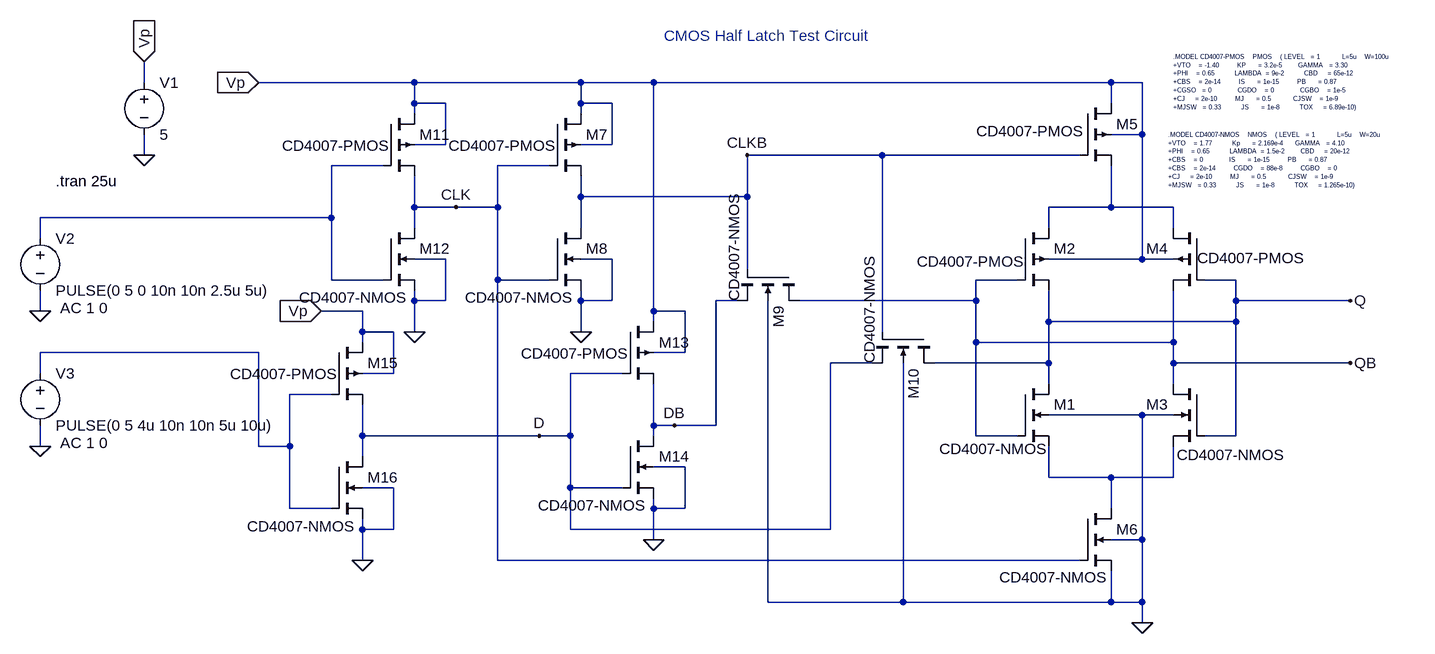
[diagram p0: schematic cmos_latch-cd4007.asc]
cmos_latch-cd4007.asc, the LTspice schematic file:
Version 4
SHEET 1 1696 680
WIRE -688 -1376 -688 -1408
WIRE -272 -1376 -512 -1376
WIRE -16 -1376 -272 -1376
WIRE 96 -1376 -16 -1376
WIRE 800 -1376 96 -1376
WIRE 848 -1376 800 -1376
WIRE -272 -1344 -272 -1376
WIRE -224 -1344 -272 -1344
WIRE -16 -1344 -16 -1376
WIRE 32 -1344 -16 -1344
WIRE 800 -1344 800 -1376
WIRE -272 -1328 -272 -1344
WIRE -16 -1328 -16 -1344
WIRE 848 -1296 848 -1376
WIRE 848 -1296 800 -1296
WIRE -224 -1280 -224 -1344
WIRE -224 -1280 -272 -1280
WIRE 32 -1280 32 -1344
WIRE 32 -1280 -16 -1280
WIRE -688 -1264 -688 -1296
WIRE 448 -1264 240 -1264
WIRE 752 -1264 448 -1264
WIRE -320 -1248 -400 -1248
WIRE -64 -1248 -144 -1248
WIRE -16 -1200 -16 -1232
WIRE 240 -1200 240 -1264
WIRE 240 -1200 -16 -1200
WIRE -272 -1184 -272 -1232
WIRE -208 -1184 -272 -1184
WIRE -144 -1184 -144 -1248
WIRE -144 -1184 -208 -1184
WIRE 800 -1184 800 -1248
WIRE 800 -1184 704 -1184
WIRE 896 -1184 800 -1184
WIRE -400 -1168 -400 -1248
WIRE -400 -1168 -848 -1168
WIRE -272 -1152 -272 -1184
WIRE -16 -1152 -16 -1200
WIRE 704 -1152 704 -1184
WIRE 896 -1152 896 -1184
WIRE -848 -1136 -848 -1168
WIRE -224 -1104 -272 -1104
WIRE 32 -1104 -16 -1104
WIRE 848 -1104 848 -1296
WIRE 848 -1104 704 -1104
WIRE 896 -1104 848 -1104
WIRE 240 -1088 240 -1200
WIRE -400 -1072 -400 -1168
WIRE -320 -1072 -400 -1072
WIRE -144 -1072 -144 -1184
WIRE -64 -1072 -144 -1072
WIRE 656 -1072 592 -1072
WIRE 992 -1072 944 -1072
WIRE -272 -1040 -272 -1056
WIRE -224 -1040 -224 -1104
WIRE -224 -1040 -272 -1040
WIRE -16 -1040 -16 -1056
WIRE 32 -1040 32 -1104
WIRE 32 -1040 -16 -1040
WIRE 224 -1040 192 -1040
WIRE 592 -1040 592 -1072
WIRE 592 -1040 320 -1040
WIRE 992 -1040 992 -1072
WIRE 1168 -1040 992 -1040
WIRE -848 -1024 -848 -1056
WIRE -352 -1024 -416 -1024
WIRE 96 -1024 96 -1376
WIRE 144 -1024 96 -1024
WIRE 96 -1008 96 -1024
WIRE 704 -1008 704 -1056
WIRE 992 -1008 992 -1040
WIRE 992 -1008 704 -1008
WIRE -352 -992 -352 -1024
WIRE -304 -992 -352 -992
WIRE -272 -992 -272 -1040
WIRE -16 -992 -16 -1040
WIRE 448 -992 448 -1264
WIRE -352 -976 -352 -992
WIRE 592 -976 592 -1040
WIRE 896 -976 896 -1056
WIRE 896 -976 592 -976
WIRE -512 -960 -848 -960
WIRE 144 -960 144 -1024
WIRE 144 -960 96 -960
WIRE 432 -944 368 -944
WIRE 704 -944 704 -1008
WIRE 704 -944 528 -944
WIRE 896 -944 896 -976
WIRE 1168 -944 896 -944
WIRE -848 -928 -848 -960
WIRE -304 -928 -304 -992
WIRE -304 -928 -352 -928
WIRE 48 -928 -32 -928
WIRE 704 -912 704 -944
WIRE 896 -912 896 -944
WIRE -400 -896 -464 -896
WIRE 848 -864 704 -864
WIRE 896 -864 848 -864
WIRE 96 -848 96 -912
WIRE 128 -848 96 -848
WIRE 192 -848 192 -1040
WIRE 192 -848 128 -848
WIRE -352 -832 -352 -880
WIRE -80 -832 -352 -832
WIRE -32 -832 -32 -928
WIRE -32 -832 -80 -832
WIRE 96 -832 96 -848
WIRE 592 -832 592 -976
WIRE 656 -832 592 -832
WIRE 992 -832 992 -1008
WIRE 992 -832 944 -832
WIRE -848 -816 -848 -848
WIRE -512 -816 -512 -960
WIRE -464 -816 -464 -896
WIRE -464 -816 -512 -816
WIRE -352 -800 -352 -832
WIRE 144 -784 96 -784
WIRE 704 -768 704 -816
WIRE 800 -768 704 -768
WIRE 896 -768 896 -816
WIRE 896 -768 800 -768
WIRE -304 -752 -352 -752
WIRE -32 -752 -32 -832
WIRE 48 -752 -32 -752
WIRE -464 -720 -464 -816
WIRE -400 -720 -464 -720
WIRE 96 -720 96 -736
WIRE 144 -720 144 -784
WIRE 144 -720 96 -720
WIRE 800 -720 800 -768
WIRE -352 -688 -352 -704
WIRE -304 -688 -304 -752
WIRE -304 -688 -352 -688
WIRE -32 -688 -32 -752
WIRE 368 -688 368 -944
WIRE 368 -688 -32 -688
WIRE 96 -672 96 -720
WIRE 848 -672 848 -864
WIRE 848 -672 800 -672
WIRE -352 -640 -352 -688
WIRE -144 -640 -144 -1072
WIRE 752 -640 -144 -640
WIRE 272 -576 272 -1040
WIRE 480 -576 480 -944
WIRE 480 -576 272 -576
WIRE 800 -576 800 -624
WIRE 800 -576 480 -576
WIRE 848 -576 848 -672
WIRE 848 -576 800 -576
WIRE 848 -544 848 -576
FLAG 848 -544 0
FLAG -512 -1376 Vp
IOPIN -512 -1376 In
FLAG -688 -1264 0
FLAG -688 -1408 Vp
IOPIN -688 -1408 In
FLAG -16 -992 0
FLAG -848 -1024 0
FLAG -208 -1184 CLK
FLAG 1168 -1040 Q
FLAG 1168 -944 QB
FLAG 96 -672 0
FLAG -80 -832 D
FLAG 240 -1264 CLKB
FLAG 128 -848 DB
FLAG -848 -816 0
FLAG -272 -992 0
FLAG -352 -640 0
FLAG -416 -1024 Vp
IOPIN -416 -1024 In
SYMBOL voltage -688 -1392 R0
WINDOW 123 0 0 Left 0
WINDOW 39 0 0 Left 0
SYMATTR InstName V1
SYMATTR Value 5
SYMBOL nmos4 656 -912 R0
WINDOW 3 -120 100 Left 2
SYMATTR Value CD4007-NMOS
SYMATTR InstName M1
SYMBOL pmos4 656 -1152 R0
WINDOW 3 -155 52 Left 2
SYMATTR Value CD4007-PMOS
SYMATTR InstName M2
SYMBOL nmos4 944 -912 M0
WINDOW 3 -126 109 Left 2
SYMATTR Value CD4007-NMOS
SYMATTR InstName M3
SYMBOL pmos4 944 -1152 M0
WINDOW 3 -156 46 Left 2
SYMATTR Value CD4007-PMOS
SYMATTR InstName M4
SYMBOL pmos4 752 -1344 R0
WINDOW 3 -159 43 Left 2
SYMATTR Value CD4007-PMOS
SYMATTR InstName M5
SYMBOL nmos4 752 -720 R0
WINDOW 3 -124 106 Left 2
SYMATTR Value CD4007-NMOS
SYMATTR InstName M6
SYMBOL pmos4 -64 -1328 R0
WINDOW 3 -156 49 Left 2
SYMATTR Value CD4007-PMOS
SYMATTR InstName M7
SYMBOL nmos4 -64 -1152 R0
WINDOW 3 -130 107 Left 2
SYMATTR Value CD4007-NMOS
SYMATTR InstName M8
SYMBOL voltage -848 -1152 R0
WINDOW 123 31 123 Left 2
WINDOW 39 0 0 Left 0
SYMATTR Value2 AC 1 0
SYMATTR InstName V2
SYMATTR Value PULSE(0 5 0 10n 10n 2.5u 5u)
SYMBOL nmos4 320 -1088 R90
WINDOW 3 -120 100 Left 2
SYMATTR Value CD4007-NMOS
SYMATTR InstName M9
SYMBOL nmos4 528 -992 R90
WINDOW 3 -120 100 Left 2
SYMATTR Value CD4007-NMOS
SYMATTR InstName M10
SYMBOL pmos4 48 -1008 R0
WINDOW 3 -156 49 Left 2
SYMATTR Value CD4007-PMOS
SYMATTR InstName M13
SYMBOL nmos4 48 -832 R0
WINDOW 3 -130 107 Left 2
SYMATTR Value CD4007-NMOS
SYMATTR InstName M14
SYMBOL voltage -848 -944 R0
WINDOW 123 31 123 Left 2
WINDOW 39 0 0 Left 0
SYMATTR Value2 AC 1 0
SYMATTR InstName V3
SYMATTR Value PULSE(0 5 4u 10n 10n 5u 10u)
SYMBOL pmos4 -320 -1328 R0
WINDOW 3 -156 49 Left 2
SYMATTR Value CD4007-PMOS
SYMATTR InstName M11
SYMBOL nmos4 -320 -1152 R0
WINDOW 3 -130 107 Left 2
SYMATTR Value CD4007-NMOS
SYMATTR InstName M12
SYMBOL pmos4 -400 -976 R0
WINDOW 3 -156 49 Left 2
SYMATTR Value CD4007-PMOS
SYMATTR InstName M15
SYMBOL nmos4 -400 -800 R0
WINDOW 3 -130 107 Left 2
SYMATTR Value CD4007-NMOS
SYMATTR InstName M16
TEXT 896 -1416 Left 0 !.MODEL CD4007-PMOS    PMOS    ( LEVEL   = 1           L=5u    W=100u                \n+VTO    = -1.40         KP      = 3.2e-5        GAMMA   = 3.30  \n+PHI    = 0.65          LAMBDA  = 9e-2          CBD     = 65e-12\n+CBS    = 2e-14         IS      = 1e-15         PB      = 0.87\n+CGSO   = 0             CGDO    = 0             CGBO    = 1e-5\n+CJ     = 2e-10         MJ      = 0.5           CJSW    = 1e-9\n+MJSW   = 0.33          JS      = 1e-8          TOX     = 6.89e-10)
TEXT 888 -1296 Left 0 !.MODEL CD4007-NMOS    NMOS    ( LEVEL   = 1           L=5u    W=20u             \n+VTO    = 1.77          Kp      = 2.169e-4      GAMMA   = 4.10  \n+PHI    = 0.65          LAMBDA  = 1.5e-2        CBD     = 20e-12\n+CBS    = 0             IS      = 1e-15         PB      = 0.87\n+CBS    = 2e-14         CGDO    = 88e-8         CGBO    = 0\n+CJ     = 2e-10         MJ      = 0.5           CJSW    = 1e-9\n+MJSW   = 0.33          JS      = 1e-8          TOX     = 1.265e-10)
TEXT 112 -1448 Left 2 ;CMOS Half Latch Test Circuit
TEXT -824 -1224 Left 2 !.tran 25u

The netlist it stands for:
* cmos_latch-cd4007.asc
V1 Vp 0 5
M1 Q QB N004 0 CD4007-NMOS
M2 N002 QB Q Vp CD4007-PMOS
M3 QB Q N004 0 CD4007-NMOS
M4 N002 Q QB Vp CD4007-PMOS
M5 Vp CLKB N002 Vp CD4007-PMOS
M6 N004 CLK 0 0 CD4007-NMOS
M7 Vp CLK CLKB Vp CD4007-PMOS
M8 CLKB CLK 0 0 CD4007-NMOS
V2 N001 0 PULSE(0 5 0 10n 10n 2.5u 5u) AC 1 0
M9 QB CLKB DB 0 CD4007-NMOS
M10 Q CLKB D 0 CD4007-NMOS
M13 Vp D DB Vp CD4007-PMOS
M14 DB D 0 0 CD4007-NMOS
V3 N003 0 PULSE(0 5 4u 10n 10n 5u 10u) AC 1 0
M11 Vp N001 CLK Vp CD4007-PMOS
M12 CLK N001 0 0 CD4007-NMOS
M15 Vp N003 D Vp CD4007-PMOS
M16 D N003 0 0 CD4007-NMOS
.model NMOS NMOS
.model PMOS PMOS
.lib standard.mos
.MODEL CD4007-PMOS    PMOS    ( LEVEL   = 1           L=5u    W=100u
+VTO    = -1.40         KP      = 3.2e-5        GAMMA   = 3.30
+PHI    = 0.65          LAMBDA  = 9e-2          CBD     = 65e-12
+CBS    = 2e-14         IS      = 1e-15         PB      = 0.87
+CGSO   = 0             CGDO    = 0             CGBO    = 1e-5
+CJ     = 2e-10         MJ      = 0.5           CJSW    = 1e-9
+MJSW   = 0.33          JS      = 1e-8          TOX     = 6.89e-10)
.MODEL CD4007-NMOS    NMOS    ( LEVEL   = 1           L=5u    W=20u
+VTO    = 1.77          Kp      = 2.169e-4      GAMMA   = 4.10
+PHI    = 0.65          LAMBDA  = 1.5e-2        CBD     = 20e-12
+CBS    = 0             IS      = 1e-15         PB      = 0.87
+CBS    = 2e-14         CGDO    = 88e-8         CGBO    = 0
+CJ     = 2e-10         MJ      = 0.5           CJSW    = 1e-9
+MJSW   = 0.33          JS      = 1e-8          TOX     = 1.265e-10)
* CMOS Half Latch Test Circuit
.tran 25u
.backanno
.end